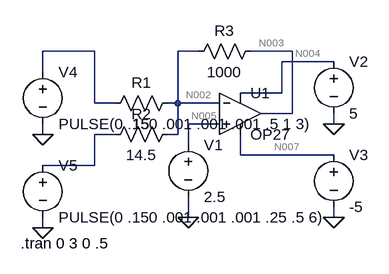
[diagram p0: schematic adaline.asc]
adaline.asc, the LTspice schematic file:
Version 4
SHEET 1 880 680
WIRE -48 32 -128 32
WIRE 112 32 80 32
WIRE 256 32 192 32
WIRE 320 48 240 48
WIRE -128 64 -128 32
WIRE 240 96 240 48
WIRE 240 96 176 96
WIRE -48 112 -48 32
WIRE -16 112 -48 112
WIRE 80 112 80 32
WIRE 80 112 64 112
WIRE 144 112 80 112
WIRE 256 128 256 32
WIRE 256 128 208 128
WIRE 144 144 96 144
WIRE 320 144 320 128
WIRE -128 160 -128 144
WIRE -16 160 -48 160
WIRE 80 160 80 112
WIRE 80 160 64 160
WIRE 96 176 96 144
WIRE 176 192 176 160
WIRE 320 192 176 192
WIRE -48 208 -48 160
WIRE -48 208 -128 208
WIRE 96 288 96 256
WIRE 320 288 320 272
WIRE -128 304 -128 288
FLAG 96 288 0
FLAG 320 144 0
FLAG 320 288 0
FLAG -128 160 0
FLAG -128 304 0
SYMBOL Opamps\\OP27 176 64 R0
SYMATTR InstName U1
SYMBOL res 80 96 R90
WINDOW 0 0 56 VBottom 2
WINDOW 3 32 56 VTop 2
SYMATTR InstName R1
SYMATTR Value 15
SYMBOL res 80 144 R90
WINDOW 0 0 56 VBottom 2
WINDOW 3 32 56 VTop 2
SYMATTR InstName R2
SYMATTR Value 14.5
SYMBOL res 208 16 R90
WINDOW 0 0 56 VBottom 2
WINDOW 3 32 56 VTop 2
SYMATTR InstName R3
SYMATTR Value 1000
SYMBOL voltage 96 160 R0
WINDOW 123 0 0 Left 2
WINDOW 39 0 0 Left 2
SYMATTR InstName V1
SYMATTR Value 2.5
SYMBOL voltage 320 32 R0
WINDOW 123 0 0 Left 2
WINDOW 39 0 0 Left 2
SYMATTR InstName V2
SYMATTR Value 5
SYMBOL voltage 320 176 R0
WINDOW 123 0 0 Left 2
WINDOW 39 0 0 Left 2
SYMATTR InstName V3
SYMATTR Value -5
SYMBOL voltage -128 48 R0
WINDOW 123 0 0 Left 2
WINDOW 39 0 0 Left 2
SYMATTR InstName V4
SYMATTR Value PULSE(0 .150 .001 .001 .001 .5 1 3)
SYMBOL voltage -128 192 R0
WINDOW 123 0 0 Left 2
WINDOW 39 0 0 Left 2
SYMATTR InstName V5
SYMATTR Value PULSE(0 .150 .001 .001 .001 .25 .5 6)
TEXT -162 328 Left 2 !.tran 0 3 0 .5

The netlist it stands for:
* adaline.asc
XU1 N005 N002 N004 N007 N003 OP27  ; pins In+ In- V+ V- OUT
R1 N002 N001 15
R2 N002 N006 14.5
R3 N003 N002 1000
V1 N005 0 2.5
V2 N004 0 5
V3 N007 0 -5
V4 N001 0 PULSE(0 .150 .001 .001 .001 .5 1 3)
V5 N006 0 PULSE(0 .150 .001 .001 .001 .25 .5 6)
.tran 0 3 0 .5
.lib ADI.lib
.backanno
.end

* Results of the author's LTspice run, read from the files saved beside the schematic
* Operating Point, zero values left out:
*   V(n002) = 28.78 mV
*   V(n005) = 2.5 V
*   V(n004) = 5 V
*   V(n003) = 3.738 V
*   V(n007) = -5 V
*   I(R3) = 3.71 mA
*   I(R2) = 1.985 mA
*   I(R1) = 1.919 mA
*   I(V5) = 1.985 mA
*   I(V4) = 1.919 mA
*   I(V3) = 1.475 mA
*   I(V2) = -5.165 mA
*   I(V1) = -194.2 µA
*   Ix(u1:1) = 194.2 µA
*   Ix(u1:2) = -194.2 µA
*   Ix(u1:3) = 5.165 mA
*   Ix(u1:4) = -1.475 mA
*   Ix(u1:5) = -3.71 mA